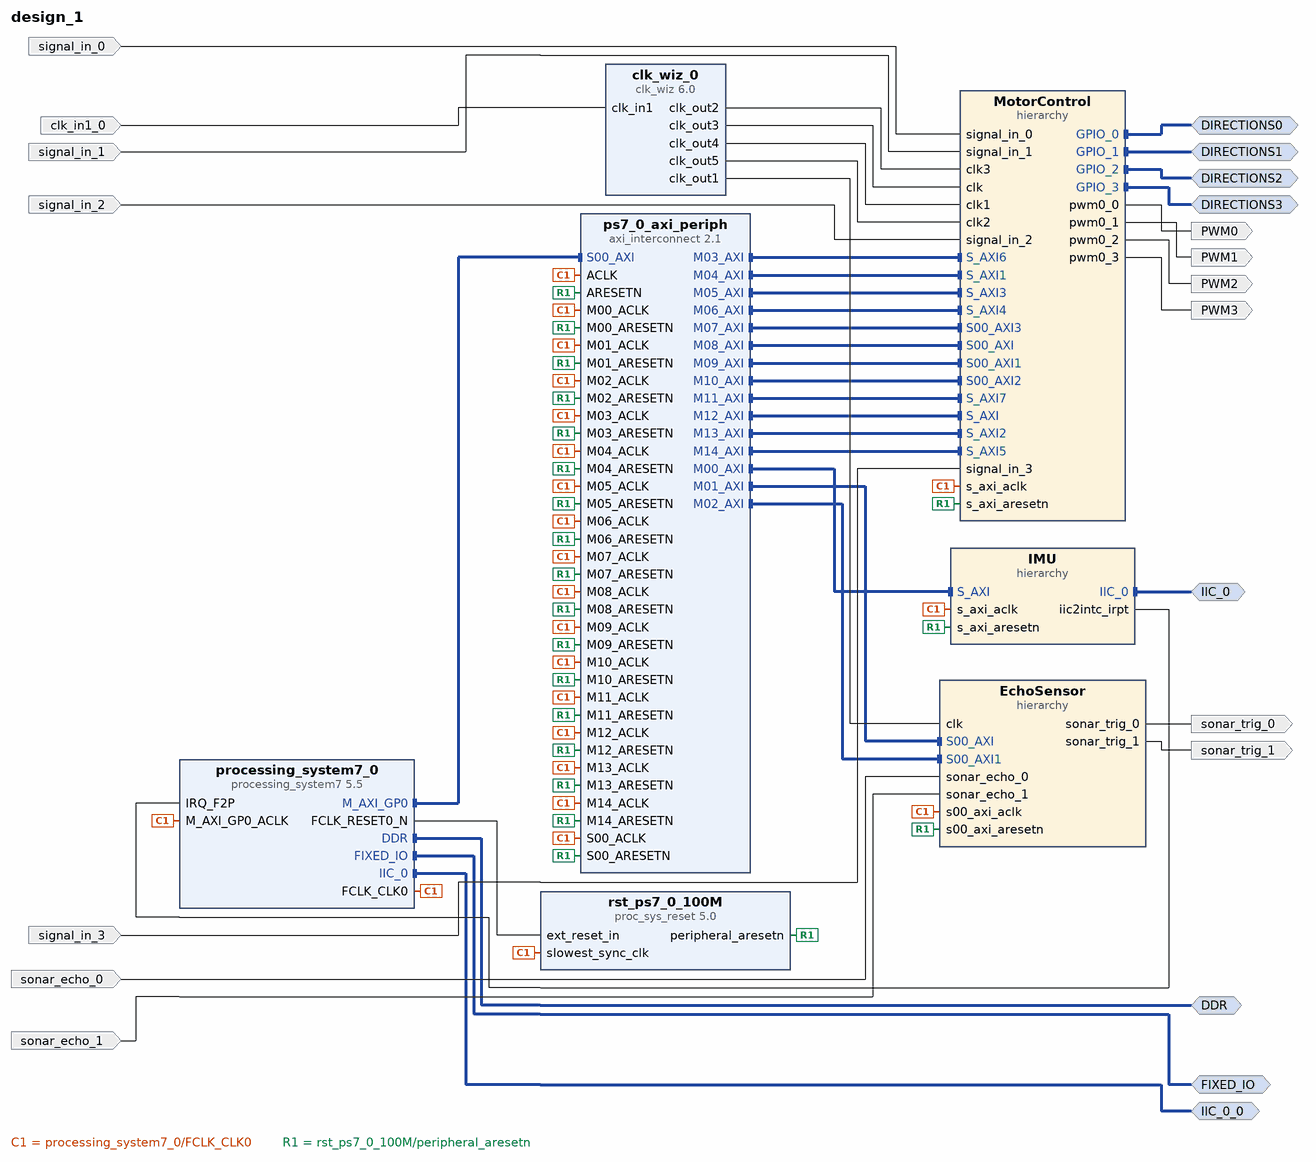
[diagram p0: block diagram of the top level]
# Vivado block design design_1, xc7z020clg400-1, Vivado 2024.1.2
create_bd_design design_1

create_bd_intf_port -mode Master -vlnv xilinx.com:interface:ddrx_rtl:1.0 DDR
create_bd_intf_port -mode Master -vlnv xilinx.com:display_processing_system7:fixedio_rtl:1.0 FIXED_IO
create_bd_intf_port -mode Master -vlnv xilinx.com:interface:iic_rtl:1.0 IIC_0
create_bd_intf_port -mode Master -vlnv xilinx.com:interface:iic_rtl:1.0 IIC_0_0
create_bd_intf_port -mode Master -vlnv xilinx.com:interface:gpio_rtl:1.0 DIRECTIONS0
create_bd_intf_port -mode Master -vlnv xilinx.com:interface:gpio_rtl:1.0 DIRECTIONS1
create_bd_intf_port -mode Master -vlnv xilinx.com:interface:gpio_rtl:1.0 DIRECTIONS2
create_bd_intf_port -mode Master -vlnv xilinx.com:interface:gpio_rtl:1.0 DIRECTIONS3
create_bd_port -dir O sonar_trig_0
create_bd_port -dir O sonar_trig_1
create_bd_port -dir I sonar_echo_0
create_bd_port -dir I sonar_echo_1
create_bd_port -dir I -type clk clk_in1_0
set_property -dict {CONFIG.FREQ_HZ 125000000} [get_bd_ports clk_in1_0]
create_bd_port -dir O PWM0
create_bd_port -dir O PWM1
create_bd_port -dir O PWM2
create_bd_port -dir O PWM3
create_bd_port -dir I signal_in_0
create_bd_port -dir I signal_in_1
create_bd_port -dir I signal_in_2
create_bd_port -dir I signal_in_3

create_bd_cell -type ip -vlnv xilinx.com:ip:processing_system7:5.5 processing_system7_0
set_property -dict [list \
  CONFIG.PCW_APU_PERIPHERAL_FREQMHZ 650 \
  CONFIG.PCW_CRYSTAL_PERIPHERAL_FREQMHZ 50 \
  CONFIG.PCW_ENET0_ENET0_IO {MIO 16 .. 27} \
  CONFIG.PCW_ENET0_GRP_MDIO_ENABLE 1 \
  CONFIG.PCW_ENET0_GRP_MDIO_IO {MIO 52 .. 53} \
  CONFIG.PCW_ENET0_PERIPHERAL_ENABLE 1 \
  CONFIG.PCW_ENET0_RESET_ENABLE 1 \
  CONFIG.PCW_ENET0_RESET_IO {MIO 9} \
  CONFIG.PCW_ENET_RESET_ENABLE 1 \
  CONFIG.PCW_ENET_RESET_SELECT {Share reset pin} \
  CONFIG.PCW_FPGA0_PERIPHERAL_FREQMHZ 100 \
  CONFIG.PCW_FPGA1_PERIPHERAL_FREQMHZ 50 \
  CONFIG.PCW_GPIO_MIO_GPIO_ENABLE 1 \
  CONFIG.PCW_GPIO_MIO_GPIO_IO MIO \
  CONFIG.PCW_I2C0_I2C0_IO EMIO \
  CONFIG.PCW_I2C0_PERIPHERAL_ENABLE 1 \
  CONFIG.PCW_I2C_PERIPHERAL_FREQMHZ 108.333336 \
  CONFIG.PCW_I2C_RESET_ENABLE 1 \
  CONFIG.PCW_I2C_RESET_SELECT {Share reset pin} \
  CONFIG.PCW_IRQ_F2P_INTR 1 \
  CONFIG.PCW_M_AXI_GP0_FREQMHZ 10 \
  CONFIG.PCW_PERIPHERAL_BOARD_PRESET None \
  CONFIG.PCW_PRESET_BANK1_VOLTAGE {LVCMOS 1.8V} \
  CONFIG.PCW_QSPI_GRP_FBCLK_ENABLE 1 \
  CONFIG.PCW_QSPI_GRP_FBCLK_IO {MIO 8} \
  CONFIG.PCW_QSPI_GRP_SINGLE_SS_ENABLE 1 \
  CONFIG.PCW_QSPI_GRP_SINGLE_SS_IO {MIO 1 .. 6} \
  CONFIG.PCW_QSPI_PERIPHERAL_ENABLE 1 \
  CONFIG.PCW_QSPI_QSPI_IO {MIO 1 .. 6} \
  CONFIG.PCW_SD0_GRP_CD_ENABLE 1 \
  CONFIG.PCW_SD0_GRP_CD_IO {MIO 47} \
  CONFIG.PCW_SD0_GRP_WP_ENABLE 0 \
  CONFIG.PCW_SD0_PERIPHERAL_ENABLE 1 \
  CONFIG.PCW_SD0_SD0_IO {MIO 40 .. 45} \
  CONFIG.PCW_SDIO_PERIPHERAL_FREQMHZ 50 \
  CONFIG.PCW_SINGLE_QSPI_DATA_MODE x4 \
  CONFIG.PCW_UART0_PERIPHERAL_ENABLE 1 \
  CONFIG.PCW_UART0_UART0_IO {MIO 14 .. 15} \
  CONFIG.PCW_UART1_PERIPHERAL_ENABLE 0 \
  CONFIG.PCW_UART_PERIPHERAL_FREQMHZ 100 \
  CONFIG.PCW_UIPARAM_DDR_BUS_WIDTH {16 Bit} \
  CONFIG.PCW_UIPARAM_DDR_FREQ_MHZ 525 \
  CONFIG.PCW_UIPARAM_DDR_PARTNO {MT41J256M16 RE-125} \
  CONFIG.PCW_USB0_PERIPHERAL_ENABLE 1 \
  CONFIG.PCW_USB0_RESET_ENABLE 1 \
  CONFIG.PCW_USB0_RESET_IO {MIO 46} \
  CONFIG.PCW_USB0_USB0_IO {MIO 28 .. 39} \
  CONFIG.PCW_USB_RESET_ENABLE 1 \
  CONFIG.PCW_USB_RESET_SELECT {Share reset pin} \
  CONFIG.PCW_USE_FABRIC_INTERRUPT 1 \
] [get_bd_cells processing_system7_0]
# 495 more settings of processing_system7_0 are not shown: defaults, MIO pin electricals, DDR timing, and values the tool derives
create_bd_cell -type ip -vlnv xilinx.com:ip:clk_wiz:6.0 clk_wiz_0
set_property -dict [list \
  CONFIG.CLKIN1_JITTER_PS 80.0 \
  CONFIG.CLKOUT1_JITTER 136.756 \
  CONFIG.CLKOUT1_PHASE_ERROR 122.096 \
  CONFIG.CLKOUT1_REQUESTED_DUTY_CYCLE 50.0 \
  CONFIG.CLKOUT2_JITTER 249.501 \
  CONFIG.CLKOUT2_PHASE_ERROR 122.096 \
  CONFIG.CLKOUT2_REQUESTED_OUT_FREQ 5 \
  CONFIG.CLKOUT2_USED true \
  CONFIG.CLKOUT3_JITTER 249.501 \
  CONFIG.CLKOUT3_PHASE_ERROR 122.096 \
  CONFIG.CLKOUT3_REQUESTED_OUT_FREQ 5 \
  CONFIG.CLKOUT3_USED true \
  CONFIG.CLKOUT4_JITTER 249.501 \
  CONFIG.CLKOUT4_PHASE_ERROR 122.096 \
  CONFIG.CLKOUT4_REQUESTED_OUT_FREQ 5 \
  CONFIG.CLKOUT4_USED true \
  CONFIG.CLKOUT5_JITTER 249.501 \
  CONFIG.CLKOUT5_PHASE_ERROR 122.096 \
  CONFIG.CLKOUT5_REQUESTED_OUT_FREQ 5 \
  CONFIG.CLKOUT5_USED true \
  CONFIG.MMCM_BANDWIDTH OPTIMIZED \
  CONFIG.MMCM_CLKFBOUT_MULT_F 5.000 \
  CONFIG.MMCM_CLKIN1_PERIOD 8.000 \
  CONFIG.MMCM_CLKOUT0_DIVIDE_F 6.250 \
  CONFIG.MMCM_CLKOUT1_DIVIDE 125 \
  CONFIG.MMCM_CLKOUT2_DIVIDE 125 \
  CONFIG.MMCM_CLKOUT3_DIVIDE 125 \
  CONFIG.MMCM_CLKOUT4_DIVIDE 125 \
  CONFIG.MMCM_DIVCLK_DIVIDE 1 \
  CONFIG.NUM_OUT_CLKS 5 \
  CONFIG.USE_LOCKED false \
  CONFIG.USE_RESET false \
  CONFIG.USE_SPREAD_SPECTRUM false \
] [get_bd_cells clk_wiz_0]
create_bd_cell -type ip -vlnv xilinx.com:ip:axi_interconnect:2.1 ps7_0_axi_periph
set_property -dict {CONFIG.NUM_MI 15} [get_bd_cells ps7_0_axi_periph]
create_bd_cell -type ip -vlnv xilinx.com:ip:proc_sys_reset:5.0 rst_ps7_0_100M
create_bd_cell -type hier MotorControl
create_bd_cell -type hier EchoSensor
create_bd_cell -type hier IMU

# ---- hierarchy /MotorControl ----
current_bd_instance /MotorControl
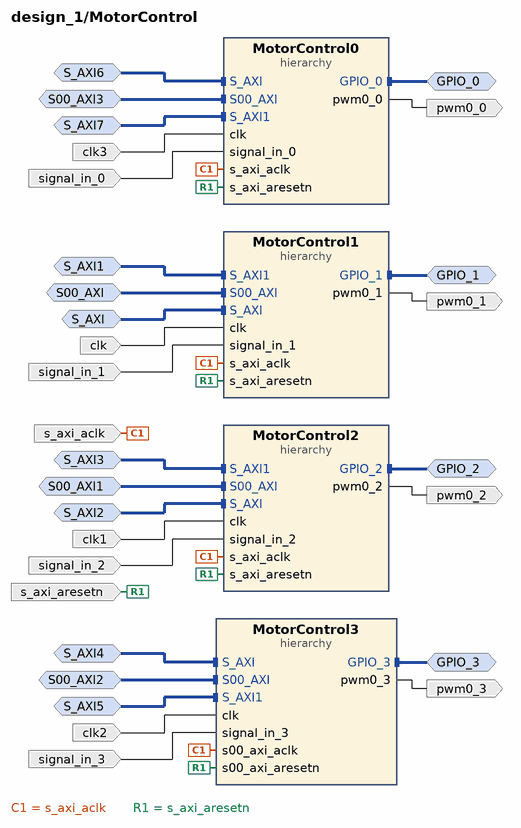
[diagram p1: block diagram inside /MotorControl]
create_bd_intf_pin -mode Slave -vlnv xilinx.com:interface:aximm_rtl:1.0 S00_AXI
create_bd_intf_pin -mode Slave -vlnv xilinx.com:interface:aximm_rtl:1.0 S_AXI
create_bd_intf_pin -mode Master -vlnv xilinx.com:interface:gpio_rtl:1.0 GPIO_1
create_bd_intf_pin -mode Slave -vlnv xilinx.com:interface:aximm_rtl:1.0 S_AXI1
create_bd_intf_pin -mode Slave -vlnv xilinx.com:interface:aximm_rtl:1.0 S00_AXI1
create_bd_intf_pin -mode Slave -vlnv xilinx.com:interface:aximm_rtl:1.0 S_AXI2
create_bd_intf_pin -mode Master -vlnv xilinx.com:interface:gpio_rtl:1.0 GPIO_2
create_bd_intf_pin -mode Slave -vlnv xilinx.com:interface:aximm_rtl:1.0 S_AXI3
create_bd_intf_pin -mode Slave -vlnv xilinx.com:interface:aximm_rtl:1.0 S_AXI4
create_bd_intf_pin -mode Slave -vlnv xilinx.com:interface:aximm_rtl:1.0 S_AXI5
create_bd_intf_pin -mode Master -vlnv xilinx.com:interface:gpio_rtl:1.0 GPIO_3
create_bd_intf_pin -mode Slave -vlnv xilinx.com:interface:aximm_rtl:1.0 S00_AXI2
create_bd_intf_pin -mode Master -vlnv xilinx.com:interface:gpio_rtl:1.0 GPIO_0
create_bd_intf_pin -mode Slave -vlnv xilinx.com:interface:aximm_rtl:1.0 S_AXI7
create_bd_intf_pin -mode Slave -vlnv xilinx.com:interface:aximm_rtl:1.0 S_AXI6
create_bd_intf_pin -mode Slave -vlnv xilinx.com:interface:aximm_rtl:1.0 S00_AXI3
create_bd_pin -dir I signal_in_1
create_bd_pin -dir I -type clk clk
create_bd_pin -dir I -type clk s_axi_aclk
create_bd_pin -dir I -type rst s_axi_aresetn
create_bd_pin -dir O pwm0_1
create_bd_pin -dir I signal_in_2
create_bd_pin -dir I -type clk clk1
create_bd_pin -dir O pwm0_2
create_bd_pin -dir O pwm0_3
create_bd_pin -dir I signal_in_3
create_bd_pin -dir I -type clk clk2
create_bd_pin -dir O pwm0_0
create_bd_pin -dir I -type clk clk3
create_bd_pin -dir I signal_in_0

create_bd_cell -type hier MotorControl1
create_bd_cell -type hier MotorControl2
create_bd_cell -type hier MotorControl3
create_bd_cell -type hier MotorControl0

# ---- hierarchy /MotorControl/MotorControl1 ----
current_bd_instance /MotorControl/MotorControl1
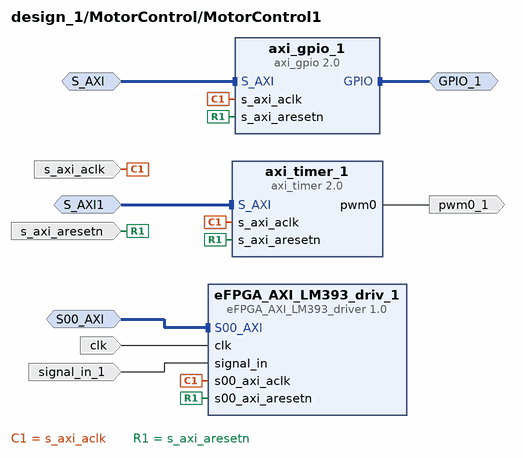
[diagram p2: block diagram inside /MotorControl/MotorControl1]
create_bd_intf_pin -mode Slave -vlnv xilinx.com:interface:aximm_rtl:1.0 S00_AXI
create_bd_intf_pin -mode Slave -vlnv xilinx.com:interface:aximm_rtl:1.0 S_AXI
create_bd_intf_pin -mode Master -vlnv xilinx.com:interface:gpio_rtl:1.0 GPIO_1
create_bd_intf_pin -mode Slave -vlnv xilinx.com:interface:aximm_rtl:1.0 S_AXI1
create_bd_pin -dir I signal_in_1
create_bd_pin -dir I -type clk clk
create_bd_pin -dir I -type clk s_axi_aclk
create_bd_pin -dir I -type rst s_axi_aresetn
create_bd_pin -dir O pwm0_1

create_bd_cell -type ip -vlnv xilinx.com:user:eFPGA_AXI_LM393_driver:1.0 eFPGA_AXI_LM393_driv_1
create_bd_cell -type ip -vlnv xilinx.com:ip:axi_gpio:2.0 axi_gpio_1
set_property -dict {CONFIG.C_ALL_OUTPUTS 1 CONFIG.C_GPIO_WIDTH 2} [get_bd_cells axi_gpio_1]
create_bd_cell -type ip -vlnv xilinx.com:ip:axi_timer:2.0 axi_timer_1

# ---- hierarchy /MotorControl/MotorControl2 ----
current_bd_instance /MotorControl/MotorControl2
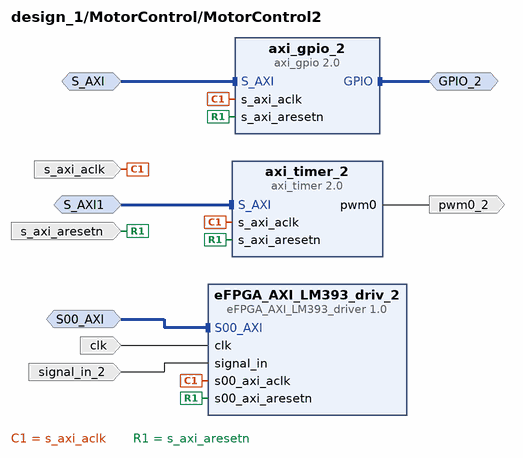
[diagram p3: block diagram inside /MotorControl/MotorControl2]
create_bd_intf_pin -mode Slave -vlnv xilinx.com:interface:aximm_rtl:1.0 S00_AXI
create_bd_intf_pin -mode Slave -vlnv xilinx.com:interface:aximm_rtl:1.0 S_AXI
create_bd_intf_pin -mode Master -vlnv xilinx.com:interface:gpio_rtl:1.0 GPIO_2
create_bd_intf_pin -mode Slave -vlnv xilinx.com:interface:aximm_rtl:1.0 S_AXI1
create_bd_pin -dir I signal_in_2
create_bd_pin -dir I -type clk clk
create_bd_pin -dir I -type clk s_axi_aclk
create_bd_pin -dir I -type rst s_axi_aresetn
create_bd_pin -dir O pwm0_2

create_bd_cell -type ip -vlnv xilinx.com:user:eFPGA_AXI_LM393_driver:1.0 eFPGA_AXI_LM393_driv_2
create_bd_cell -type ip -vlnv xilinx.com:ip:axi_gpio:2.0 axi_gpio_2
set_property -dict {CONFIG.C_ALL_OUTPUTS 1 CONFIG.C_GPIO_WIDTH 2} [get_bd_cells axi_gpio_2]
create_bd_cell -type ip -vlnv xilinx.com:ip:axi_timer:2.0 axi_timer_2

# ---- hierarchy /MotorControl/MotorControl3 ----
current_bd_instance /MotorControl/MotorControl3
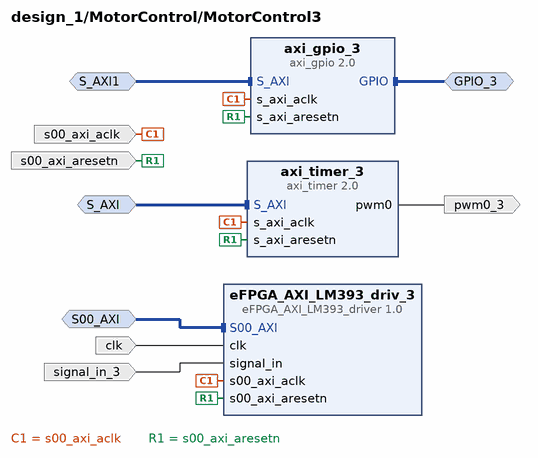
[diagram p4: block diagram inside /MotorControl/MotorControl3]
create_bd_intf_pin -mode Slave -vlnv xilinx.com:interface:aximm_rtl:1.0 S_AXI
create_bd_intf_pin -mode Slave -vlnv xilinx.com:interface:aximm_rtl:1.0 S_AXI1
create_bd_intf_pin -mode Master -vlnv xilinx.com:interface:gpio_rtl:1.0 GPIO_3
create_bd_intf_pin -mode Slave -vlnv xilinx.com:interface:aximm_rtl:1.0 S00_AXI
create_bd_pin -dir O pwm0_3
create_bd_pin -dir I -type clk s00_axi_aclk
create_bd_pin -dir I -type rst s00_axi_aresetn
create_bd_pin -dir I signal_in_3
create_bd_pin -dir I -type clk clk

create_bd_cell -type ip -vlnv xilinx.com:ip:axi_timer:2.0 axi_timer_3
create_bd_cell -type ip -vlnv xilinx.com:ip:axi_gpio:2.0 axi_gpio_3
set_property -dict {CONFIG.C_ALL_OUTPUTS 1 CONFIG.C_GPIO_WIDTH 2} [get_bd_cells axi_gpio_3]
create_bd_cell -type ip -vlnv xilinx.com:user:eFPGA_AXI_LM393_driver:1.0 eFPGA_AXI_LM393_driv_3

# ---- hierarchy /MotorControl/MotorControl0 ----
current_bd_instance /MotorControl/MotorControl0
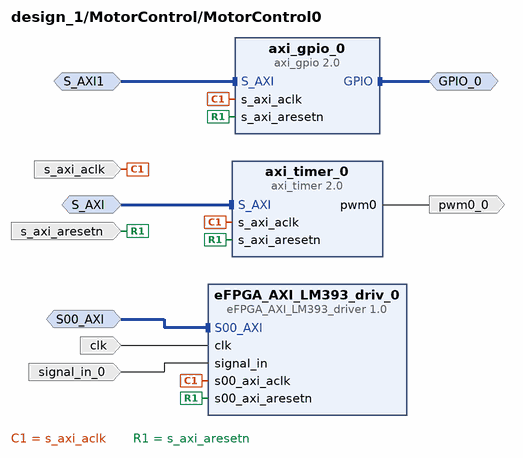
[diagram p5: block diagram inside /MotorControl/MotorControl0]
create_bd_intf_pin -mode Slave -vlnv xilinx.com:interface:aximm_rtl:1.0 S00_AXI
create_bd_intf_pin -mode Slave -vlnv xilinx.com:interface:aximm_rtl:1.0 S_AXI
create_bd_intf_pin -mode Slave -vlnv xilinx.com:interface:aximm_rtl:1.0 S_AXI1
create_bd_intf_pin -mode Master -vlnv xilinx.com:interface:gpio_rtl:1.0 GPIO_0
create_bd_pin -dir I signal_in_0
create_bd_pin -dir I -type clk clk
create_bd_pin -dir I -type clk s_axi_aclk
create_bd_pin -dir I -type rst s_axi_aresetn
create_bd_pin -dir O pwm0_0

create_bd_cell -type ip -vlnv xilinx.com:user:eFPGA_AXI_LM393_driver:1.0 eFPGA_AXI_LM393_driv_0
create_bd_cell -type ip -vlnv xilinx.com:ip:axi_timer:2.0 axi_timer_0
create_bd_cell -type ip -vlnv xilinx.com:ip:axi_gpio:2.0 axi_gpio_0
set_property -dict {CONFIG.C_ALL_OUTPUTS 1 CONFIG.C_GPIO_WIDTH 2} [get_bd_cells axi_gpio_0]

# ---- hierarchy /EchoSensor ----
current_bd_instance /EchoSensor
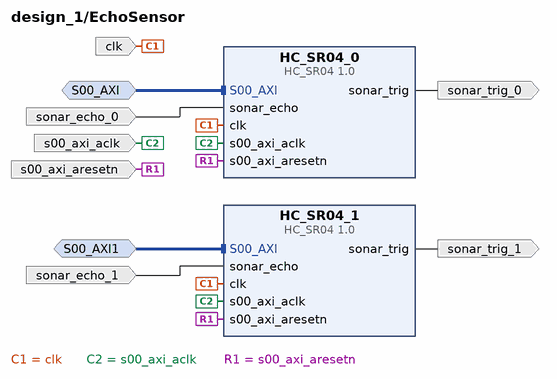
[diagram p6: block diagram inside /EchoSensor]
create_bd_intf_pin -mode Slave -vlnv xilinx.com:interface:aximm_rtl:1.0 S00_AXI
create_bd_intf_pin -mode Slave -vlnv xilinx.com:interface:aximm_rtl:1.0 S00_AXI1
create_bd_pin -dir I -type clk clk
create_bd_pin -dir O sonar_trig_0
create_bd_pin -dir I sonar_echo_0
create_bd_pin -dir I -type clk s00_axi_aclk
create_bd_pin -dir I -type rst s00_axi_aresetn
create_bd_pin -dir O sonar_trig_1
create_bd_pin -dir I sonar_echo_1

create_bd_cell -type ip -vlnv xilinx.com:user:HC_SR04:1.0 HC_SR04_0
create_bd_cell -type ip -vlnv xilinx.com:user:HC_SR04:1.0 HC_SR04_1

# ---- hierarchy /IMU ----
current_bd_instance /IMU
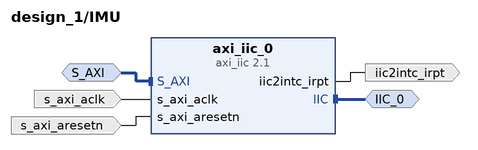
[diagram p7: block diagram inside /IMU]
create_bd_intf_pin -mode Slave -vlnv xilinx.com:interface:aximm_rtl:1.0 S_AXI
create_bd_intf_pin -mode Master -vlnv xilinx.com:interface:iic_rtl:1.0 IIC_0
create_bd_pin -dir I -type clk s_axi_aclk
create_bd_pin -dir I -type rst s_axi_aresetn
create_bd_pin -dir O -type intr iic2intc_irpt

create_bd_cell -type ip -vlnv xilinx.com:ip:axi_iic:2.1 axi_iic_0

# ---- connections ----

current_bd_instance /MotorControl
connect_bd_intf_net -intf_net axi_gpio_0_GPIO [get_bd_intf_pins GPIO_0] [get_bd_intf_pins MotorControl0/GPIO_0]
connect_bd_intf_net -intf_net axi_gpio_1_GPIO [get_bd_intf_pins GPIO_1] [get_bd_intf_pins MotorControl1/GPIO_1]
connect_bd_intf_net -intf_net axi_gpio_2_GPIO [get_bd_intf_pins GPIO_2] [get_bd_intf_pins MotorControl2/GPIO_2]
connect_bd_intf_net -intf_net axi_gpio_3_GPIO [get_bd_intf_pins GPIO_3] [get_bd_intf_pins MotorControl3/GPIO_3]
connect_bd_intf_net [get_bd_intf_pins S_AXI6] [get_bd_intf_pins MotorControl0/S_AXI]
connect_bd_intf_net [get_bd_intf_pins S_AXI1] [get_bd_intf_pins MotorControl1/S_AXI1]
connect_bd_intf_net [get_bd_intf_pins S_AXI3] [get_bd_intf_pins MotorControl2/S_AXI1]
connect_bd_intf_net [get_bd_intf_pins S_AXI4] [get_bd_intf_pins MotorControl3/S_AXI]
connect_bd_intf_net [get_bd_intf_pins S00_AXI3] [get_bd_intf_pins MotorControl0/S00_AXI]
connect_bd_intf_net [get_bd_intf_pins S00_AXI] [get_bd_intf_pins MotorControl1/S00_AXI]
connect_bd_intf_net [get_bd_intf_pins S00_AXI1] [get_bd_intf_pins MotorControl2/S00_AXI]
connect_bd_intf_net [get_bd_intf_pins S00_AXI2] [get_bd_intf_pins MotorControl3/S00_AXI]
connect_bd_intf_net [get_bd_intf_pins S_AXI7] [get_bd_intf_pins MotorControl0/S_AXI1]
connect_bd_intf_net [get_bd_intf_pins S_AXI] [get_bd_intf_pins MotorControl1/S_AXI]
connect_bd_intf_net [get_bd_intf_pins S_AXI2] [get_bd_intf_pins MotorControl2/S_AXI]
connect_bd_intf_net [get_bd_intf_pins S_AXI5] [get_bd_intf_pins MotorControl3/S_AXI1]
connect_bd_net -net axi_timer_0_pwm0 [get_bd_pins MotorControl0/pwm0_0] [get_bd_pins pwm0_0]
connect_bd_net -net axi_timer_1_pwm0 [get_bd_pins MotorControl1/pwm0_1] [get_bd_pins pwm0_1]
connect_bd_net -net axi_timer_2_pwm0 [get_bd_pins MotorControl2/pwm0_2] [get_bd_pins pwm0_2]
connect_bd_net -net axi_timer_3_pwm0 [get_bd_pins MotorControl3/pwm0_3] [get_bd_pins pwm0_3]
connect_bd_net -net clk_wiz_0_clk_out2 [get_bd_pins clk3] [get_bd_pins MotorControl0/clk]
connect_bd_net -net clk_wiz_0_clk_out3 [get_bd_pins clk] [get_bd_pins MotorControl1/clk]
connect_bd_net -net clk_wiz_0_clk_out4 [get_bd_pins clk1] [get_bd_pins MotorControl2/clk]
connect_bd_net -net clk_wiz_0_clk_out5 [get_bd_pins clk2] [get_bd_pins MotorControl3/clk]
connect_bd_net -net processing_system7_0_FCLK_CLK0 [get_bd_pins s_axi_aclk] \
  [get_bd_pins MotorControl2/s_axi_aclk] [get_bd_pins MotorControl3/s00_axi_aclk] [get_bd_pins MotorControl1/s_axi_aclk] \
  [get_bd_pins MotorControl0/s_axi_aclk]
connect_bd_net -net rst_ps7_0_100M_peripheral_aresetn [get_bd_pins s_axi_aresetn] \
  [get_bd_pins MotorControl2/s_axi_aresetn] [get_bd_pins MotorControl3/s00_axi_aresetn] \
  [get_bd_pins MotorControl1/s_axi_aresetn] [get_bd_pins MotorControl0/s_axi_aresetn]
connect_bd_net -net signal_in_0_1 [get_bd_pins signal_in_0] [get_bd_pins MotorControl0/signal_in_0]
connect_bd_net -net signal_in_1_1 [get_bd_pins signal_in_1] [get_bd_pins MotorControl1/signal_in_1]
connect_bd_net -net signal_in_2_1 [get_bd_pins signal_in_2] [get_bd_pins MotorControl2/signal_in_2]
connect_bd_net -net signal_in_3_1 [get_bd_pins signal_in_3] [get_bd_pins MotorControl3/signal_in_3]

current_bd_instance /MotorControl/MotorControl1
connect_bd_intf_net [get_bd_intf_pins GPIO_1] [get_bd_intf_pins axi_gpio_1/GPIO]
connect_bd_intf_net [get_bd_intf_pins S_AXI1] [get_bd_intf_pins axi_timer_1/S_AXI]
connect_bd_intf_net [get_bd_intf_pins S00_AXI] [get_bd_intf_pins eFPGA_AXI_LM393_driv_1/S00_AXI]
connect_bd_intf_net [get_bd_intf_pins S_AXI] [get_bd_intf_pins axi_gpio_1/S_AXI]
connect_bd_net [get_bd_pins axi_timer_1/pwm0] [get_bd_pins pwm0_1]
connect_bd_net -net clk_wiz_0_clk_out3 [get_bd_pins clk] [get_bd_pins eFPGA_AXI_LM393_driv_1/clk]
connect_bd_net -net processing_system7_0_FCLK_CLK0 [get_bd_pins s_axi_aclk] \
  [get_bd_pins axi_timer_1/s_axi_aclk] [get_bd_pins axi_gpio_1/s_axi_aclk] [get_bd_pins eFPGA_AXI_LM393_driv_1/s00_axi_aclk]
connect_bd_net -net rst_ps7_0_100M_peripheral_aresetn [get_bd_pins s_axi_aresetn] \
  [get_bd_pins axi_timer_1/s_axi_aresetn] [get_bd_pins axi_gpio_1/s_axi_aresetn] \
  [get_bd_pins eFPGA_AXI_LM393_driv_1/s00_axi_aresetn]
connect_bd_net -net signal_in_1_1 [get_bd_pins signal_in_1] [get_bd_pins eFPGA_AXI_LM393_driv_1/signal_in]

current_bd_instance /MotorControl/MotorControl2
connect_bd_intf_net [get_bd_intf_pins GPIO_2] [get_bd_intf_pins axi_gpio_2/GPIO]
connect_bd_intf_net [get_bd_intf_pins S_AXI1] [get_bd_intf_pins axi_timer_2/S_AXI]
connect_bd_intf_net [get_bd_intf_pins S00_AXI] [get_bd_intf_pins eFPGA_AXI_LM393_driv_2/S00_AXI]
connect_bd_intf_net [get_bd_intf_pins S_AXI] [get_bd_intf_pins axi_gpio_2/S_AXI]
connect_bd_net [get_bd_pins axi_timer_2/pwm0] [get_bd_pins pwm0_2]
connect_bd_net -net clk_wiz_0_clk_out4 [get_bd_pins clk] [get_bd_pins eFPGA_AXI_LM393_driv_2/clk]
connect_bd_net -net processing_system7_0_FCLK_CLK0 [get_bd_pins s_axi_aclk] \
  [get_bd_pins axi_timer_2/s_axi_aclk] [get_bd_pins axi_gpio_2/s_axi_aclk] [get_bd_pins eFPGA_AXI_LM393_driv_2/s00_axi_aclk]
connect_bd_net -net rst_ps7_0_100M_peripheral_aresetn [get_bd_pins s_axi_aresetn] \
  [get_bd_pins axi_timer_2/s_axi_aresetn] [get_bd_pins axi_gpio_2/s_axi_aresetn] \
  [get_bd_pins eFPGA_AXI_LM393_driv_2/s00_axi_aresetn]
connect_bd_net -net signal_in_2_1 [get_bd_pins signal_in_2] [get_bd_pins eFPGA_AXI_LM393_driv_2/signal_in]

current_bd_instance /MotorControl/MotorControl3
connect_bd_intf_net [get_bd_intf_pins GPIO_3] [get_bd_intf_pins axi_gpio_3/GPIO]
connect_bd_intf_net [get_bd_intf_pins S_AXI] [get_bd_intf_pins axi_timer_3/S_AXI]
connect_bd_intf_net [get_bd_intf_pins S00_AXI] [get_bd_intf_pins eFPGA_AXI_LM393_driv_3/S00_AXI]
connect_bd_intf_net [get_bd_intf_pins S_AXI1] [get_bd_intf_pins axi_gpio_3/S_AXI]
connect_bd_net [get_bd_pins axi_timer_3/pwm0] [get_bd_pins pwm0_3]
connect_bd_net -net clk_wiz_0_clk_out5 [get_bd_pins clk] [get_bd_pins eFPGA_AXI_LM393_driv_3/clk]
connect_bd_net -net processing_system7_0_FCLK_CLK0 [get_bd_pins s00_axi_aclk] \
  [get_bd_pins eFPGA_AXI_LM393_driv_3/s00_axi_aclk] [get_bd_pins axi_gpio_3/s_axi_aclk] [get_bd_pins axi_timer_3/s_axi_aclk]
connect_bd_net -net rst_ps7_0_100M_peripheral_aresetn [get_bd_pins s00_axi_aresetn] \
  [get_bd_pins eFPGA_AXI_LM393_driv_3/s00_axi_aresetn] [get_bd_pins axi_gpio_3/s_axi_aresetn] \
  [get_bd_pins axi_timer_3/s_axi_aresetn]
connect_bd_net -net signal_in_3_1 [get_bd_pins signal_in_3] [get_bd_pins eFPGA_AXI_LM393_driv_3/signal_in]

current_bd_instance /MotorControl/MotorControl0
connect_bd_intf_net [get_bd_intf_pins GPIO_0] [get_bd_intf_pins axi_gpio_0/GPIO]
connect_bd_intf_net [get_bd_intf_pins S_AXI] [get_bd_intf_pins axi_timer_0/S_AXI]
connect_bd_intf_net [get_bd_intf_pins S00_AXI] [get_bd_intf_pins eFPGA_AXI_LM393_driv_0/S00_AXI]
connect_bd_intf_net [get_bd_intf_pins S_AXI1] [get_bd_intf_pins axi_gpio_0/S_AXI]
connect_bd_net [get_bd_pins axi_timer_0/pwm0] [get_bd_pins pwm0_0]
connect_bd_net -net clk_wiz_0_clk_out2 [get_bd_pins clk] [get_bd_pins eFPGA_AXI_LM393_driv_0/clk]
connect_bd_net -net processing_system7_0_FCLK_CLK0 [get_bd_pins s_axi_aclk] \
  [get_bd_pins axi_timer_0/s_axi_aclk] [get_bd_pins axi_gpio_0/s_axi_aclk] [get_bd_pins eFPGA_AXI_LM393_driv_0/s00_axi_aclk]
connect_bd_net -net rst_ps7_0_100M_peripheral_aresetn [get_bd_pins s_axi_aresetn] \
  [get_bd_pins axi_timer_0/s_axi_aresetn] [get_bd_pins axi_gpio_0/s_axi_aresetn] \
  [get_bd_pins eFPGA_AXI_LM393_driv_0/s00_axi_aresetn]
connect_bd_net -net signal_in_0_1 [get_bd_pins signal_in_0] [get_bd_pins eFPGA_AXI_LM393_driv_0/signal_in]

current_bd_instance /EchoSensor
connect_bd_intf_net [get_bd_intf_pins S00_AXI] [get_bd_intf_pins HC_SR04_0/S00_AXI]
connect_bd_intf_net [get_bd_intf_pins S00_AXI1] [get_bd_intf_pins HC_SR04_1/S00_AXI]
connect_bd_net [get_bd_pins HC_SR04_0/sonar_trig] [get_bd_pins sonar_trig_0]
connect_bd_net [get_bd_pins HC_SR04_1/sonar_trig] [get_bd_pins sonar_trig_1]
connect_bd_net -net clk_wiz_0_clk_out1 [get_bd_pins clk] [get_bd_pins HC_SR04_1/clk] [get_bd_pins HC_SR04_0/clk]
connect_bd_net -net processing_system7_0_FCLK_CLK0 [get_bd_pins s00_axi_aclk] \
  [get_bd_pins HC_SR04_1/s00_axi_aclk] [get_bd_pins HC_SR04_0/s00_axi_aclk]
connect_bd_net -net rst_ps7_0_100M_peripheral_aresetn [get_bd_pins s00_axi_aresetn] \
  [get_bd_pins HC_SR04_1/s00_axi_aresetn] [get_bd_pins HC_SR04_0/s00_axi_aresetn]
connect_bd_net -net sonar_echo_0_1 [get_bd_pins sonar_echo_0] [get_bd_pins HC_SR04_0/sonar_echo]
connect_bd_net -net sonar_echo_1_1 [get_bd_pins sonar_echo_1] [get_bd_pins HC_SR04_1/sonar_echo]

current_bd_instance /IMU
connect_bd_intf_net [get_bd_intf_pins IIC_0] [get_bd_intf_pins axi_iic_0/IIC]
connect_bd_intf_net [get_bd_intf_pins S_AXI] [get_bd_intf_pins axi_iic_0/S_AXI]
connect_bd_net [get_bd_pins axi_iic_0/iic2intc_irpt] [get_bd_pins iic2intc_irpt]
connect_bd_net -net processing_system7_0_FCLK_CLK0 [get_bd_pins s_axi_aclk] [get_bd_pins axi_iic_0/s_axi_aclk]
connect_bd_net -net rst_ps7_0_100M_peripheral_aresetn [get_bd_pins s_axi_aresetn] [get_bd_pins axi_iic_0/s_axi_aresetn]

current_bd_instance /
connect_bd_intf_net -intf_net axi_gpio_0_GPIO [get_bd_intf_ports DIRECTIONS0] [get_bd_intf_pins MotorControl/GPIO_0]
connect_bd_intf_net -intf_net axi_gpio_1_GPIO [get_bd_intf_ports DIRECTIONS1] [get_bd_intf_pins MotorControl/GPIO_1]
connect_bd_intf_net -intf_net axi_gpio_2_GPIO [get_bd_intf_ports DIRECTIONS2] [get_bd_intf_pins MotorControl/GPIO_2]
connect_bd_intf_net -intf_net axi_gpio_3_GPIO [get_bd_intf_ports DIRECTIONS3] [get_bd_intf_pins MotorControl/GPIO_3]
connect_bd_intf_net -intf_net axi_iic_0_IIC [get_bd_intf_ports IIC_0] [get_bd_intf_pins IMU/IIC_0]
connect_bd_intf_net [get_bd_intf_ports DDR] [get_bd_intf_pins processing_system7_0/DDR]
connect_bd_intf_net [get_bd_intf_ports FIXED_IO] [get_bd_intf_pins processing_system7_0/FIXED_IO]
connect_bd_intf_net [get_bd_intf_ports IIC_0_0] [get_bd_intf_pins processing_system7_0/IIC_0]
connect_bd_intf_net [get_bd_intf_pins processing_system7_0/M_AXI_GP0] [get_bd_intf_pins ps7_0_axi_periph/S00_AXI]
connect_bd_intf_net [get_bd_intf_pins ps7_0_axi_periph/M00_AXI] [get_bd_intf_pins IMU/S_AXI]
connect_bd_intf_net [get_bd_intf_pins ps7_0_axi_periph/M01_AXI] [get_bd_intf_pins EchoSensor/S00_AXI]
connect_bd_intf_net [get_bd_intf_pins ps7_0_axi_periph/M02_AXI] [get_bd_intf_pins EchoSensor/S00_AXI1]
connect_bd_intf_net [get_bd_intf_pins ps7_0_axi_periph/M03_AXI] [get_bd_intf_pins MotorControl/S_AXI6]
connect_bd_intf_net [get_bd_intf_pins ps7_0_axi_periph/M04_AXI] [get_bd_intf_pins MotorControl/S_AXI1]
connect_bd_intf_net [get_bd_intf_pins ps7_0_axi_periph/M05_AXI] [get_bd_intf_pins MotorControl/S_AXI3]
connect_bd_intf_net [get_bd_intf_pins ps7_0_axi_periph/M06_AXI] [get_bd_intf_pins MotorControl/S_AXI4]
connect_bd_intf_net [get_bd_intf_pins ps7_0_axi_periph/M07_AXI] [get_bd_intf_pins MotorControl/S00_AXI3]
connect_bd_intf_net [get_bd_intf_pins ps7_0_axi_periph/M08_AXI] [get_bd_intf_pins MotorControl/S00_AXI]
connect_bd_intf_net [get_bd_intf_pins ps7_0_axi_periph/M09_AXI] [get_bd_intf_pins MotorControl/S00_AXI1]
connect_bd_intf_net [get_bd_intf_pins ps7_0_axi_periph/M10_AXI] [get_bd_intf_pins MotorControl/S00_AXI2]
connect_bd_intf_net [get_bd_intf_pins ps7_0_axi_periph/M11_AXI] [get_bd_intf_pins MotorControl/S_AXI7]
connect_bd_intf_net [get_bd_intf_pins ps7_0_axi_periph/M12_AXI] [get_bd_intf_pins MotorControl/S_AXI]
connect_bd_intf_net [get_bd_intf_pins ps7_0_axi_periph/M13_AXI] [get_bd_intf_pins MotorControl/S_AXI2]
connect_bd_intf_net [get_bd_intf_pins ps7_0_axi_periph/M14_AXI] [get_bd_intf_pins MotorControl/S_AXI5]
connect_bd_net -net HC_SR04_0_sonar_trig [get_bd_pins EchoSensor/sonar_trig_0] [get_bd_ports sonar_trig_0]
connect_bd_net -net HC_SR04_1_sonar_trig [get_bd_pins EchoSensor/sonar_trig_1] [get_bd_ports sonar_trig_1]
connect_bd_net -net axi_iic_0_iic2intc_irpt [get_bd_pins IMU/iic2intc_irpt] [get_bd_pins processing_system7_0/IRQ_F2P]
connect_bd_net -net axi_timer_0_pwm0 [get_bd_pins MotorControl/pwm0_0] [get_bd_ports PWM0]
connect_bd_net -net axi_timer_1_pwm0 [get_bd_pins MotorControl/pwm0_1] [get_bd_ports PWM1]
connect_bd_net -net axi_timer_2_pwm0 [get_bd_pins MotorControl/pwm0_2] [get_bd_ports PWM2]
connect_bd_net -net axi_timer_3_pwm0 [get_bd_pins MotorControl/pwm0_3] [get_bd_ports PWM3]
connect_bd_net -net clk_in1_0_1 [get_bd_ports clk_in1_0] [get_bd_pins clk_wiz_0/clk_in1]
connect_bd_net [get_bd_pins clk_wiz_0/clk_out1] [get_bd_pins EchoSensor/clk]
connect_bd_net [get_bd_pins clk_wiz_0/clk_out2] [get_bd_pins MotorControl/clk3]
connect_bd_net [get_bd_pins clk_wiz_0/clk_out3] [get_bd_pins MotorControl/clk]
connect_bd_net [get_bd_pins clk_wiz_0/clk_out4] [get_bd_pins MotorControl/clk1]
connect_bd_net [get_bd_pins clk_wiz_0/clk_out5] [get_bd_pins MotorControl/clk2]
connect_bd_net [get_bd_pins processing_system7_0/FCLK_CLK0] \
  [get_bd_pins processing_system7_0/M_AXI_GP0_ACLK] [get_bd_pins ps7_0_axi_periph/S00_ACLK] \
  [get_bd_pins rst_ps7_0_100M/slowest_sync_clk] [get_bd_pins ps7_0_axi_periph/M00_ACLK] [get_bd_pins ps7_0_axi_periph/ACLK] \
  [get_bd_pins ps7_0_axi_periph/M01_ACLK] [get_bd_pins ps7_0_axi_periph/M02_ACLK] [get_bd_pins ps7_0_axi_periph/M03_ACLK] \
  [get_bd_pins ps7_0_axi_periph/M04_ACLK] [get_bd_pins ps7_0_axi_periph/M05_ACLK] [get_bd_pins ps7_0_axi_periph/M06_ACLK] \
  [get_bd_pins ps7_0_axi_periph/M07_ACLK] [get_bd_pins ps7_0_axi_periph/M08_ACLK] [get_bd_pins ps7_0_axi_periph/M09_ACLK] \
  [get_bd_pins ps7_0_axi_periph/M10_ACLK] [get_bd_pins ps7_0_axi_periph/M11_ACLK] [get_bd_pins ps7_0_axi_periph/M12_ACLK] \
  [get_bd_pins ps7_0_axi_periph/M13_ACLK] [get_bd_pins ps7_0_axi_periph/M14_ACLK] [get_bd_pins MotorControl/s_axi_aclk] \
  [get_bd_pins EchoSensor/s00_axi_aclk] [get_bd_pins IMU/s_axi_aclk]
connect_bd_net [get_bd_pins processing_system7_0/FCLK_RESET0_N] [get_bd_pins rst_ps7_0_100M/ext_reset_in]
connect_bd_net [get_bd_pins rst_ps7_0_100M/peripheral_aresetn] \
  [get_bd_pins ps7_0_axi_periph/S00_ARESETN] [get_bd_pins ps7_0_axi_periph/M00_ARESETN] \
  [get_bd_pins ps7_0_axi_periph/ARESETN] [get_bd_pins ps7_0_axi_periph/M01_ARESETN] \
  [get_bd_pins ps7_0_axi_periph/M02_ARESETN] [get_bd_pins ps7_0_axi_periph/M03_ARESETN] \
  [get_bd_pins ps7_0_axi_periph/M04_ARESETN] [get_bd_pins ps7_0_axi_periph/M05_ARESETN] \
  [get_bd_pins ps7_0_axi_periph/M06_ARESETN] [get_bd_pins ps7_0_axi_periph/M07_ARESETN] \
  [get_bd_pins ps7_0_axi_periph/M08_ARESETN] [get_bd_pins ps7_0_axi_periph/M09_ARESETN] \
  [get_bd_pins ps7_0_axi_periph/M10_ARESETN] [get_bd_pins ps7_0_axi_periph/M11_ARESETN] \
  [get_bd_pins ps7_0_axi_periph/M12_ARESETN] [get_bd_pins ps7_0_axi_periph/M13_ARESETN] \
  [get_bd_pins ps7_0_axi_periph/M14_ARESETN] [get_bd_pins MotorControl/s_axi_aresetn] \
  [get_bd_pins EchoSensor/s00_axi_aresetn] [get_bd_pins IMU/s_axi_aresetn]
connect_bd_net -net signal_in_0_1 [get_bd_ports signal_in_0] [get_bd_pins MotorControl/signal_in_0]
connect_bd_net -net signal_in_1_1 [get_bd_ports signal_in_1] [get_bd_pins MotorControl/signal_in_1]
connect_bd_net -net signal_in_2_1 [get_bd_ports signal_in_2] [get_bd_pins MotorControl/signal_in_2]
connect_bd_net -net signal_in_3_1 [get_bd_ports signal_in_3] [get_bd_pins MotorControl/signal_in_3]
connect_bd_net -net sonar_echo_0_1 [get_bd_ports sonar_echo_0] [get_bd_pins EchoSensor/sonar_echo_0]
connect_bd_net -net sonar_echo_1_1 [get_bd_ports sonar_echo_1] [get_bd_pins EchoSensor/sonar_echo_1]

# ---- address map ----
assign_bd_address -offset 0x41200000 -range 64K -target_address_space [get_bd_addr_spaces processing_system7_0/Data] [get_bd_addr_segs MotorControl/MotorControl0/axi_gpio_0/S_AXI/Reg]
assign_bd_address -offset 0x41210000 -range 64K -target_address_space [get_bd_addr_spaces processing_system7_0/Data] [get_bd_addr_segs MotorControl/MotorControl1/axi_gpio_1/S_AXI/Reg]
assign_bd_address -offset 0x41220000 -range 64K -target_address_space [get_bd_addr_spaces processing_system7_0/Data] [get_bd_addr_segs MotorControl/MotorControl2/axi_gpio_2/S_AXI/Reg]
assign_bd_address -offset 0x41230000 -range 64K -target_address_space [get_bd_addr_spaces processing_system7_0/Data] [get_bd_addr_segs MotorControl/MotorControl3/axi_gpio_3/S_AXI/Reg]
assign_bd_address -offset 0x41600000 -range 64K -target_address_space [get_bd_addr_spaces processing_system7_0/Data] [get_bd_addr_segs IMU/axi_iic_0/S_AXI/Reg]
assign_bd_address -offset 0x42800000 -range 64K -target_address_space [get_bd_addr_spaces processing_system7_0/Data] [get_bd_addr_segs MotorControl/MotorControl0/axi_timer_0/S_AXI/Reg]
assign_bd_address -offset 0x42810000 -range 64K -target_address_space [get_bd_addr_spaces processing_system7_0/Data] [get_bd_addr_segs MotorControl/MotorControl1/axi_timer_1/S_AXI/Reg]
assign_bd_address -offset 0x42820000 -range 64K -target_address_space [get_bd_addr_spaces processing_system7_0/Data] [get_bd_addr_segs MotorControl/MotorControl2/axi_timer_2/S_AXI/Reg]
assign_bd_address -offset 0x42830000 -range 64K -target_address_space [get_bd_addr_spaces processing_system7_0/Data] [get_bd_addr_segs MotorControl/MotorControl3/axi_timer_3/S_AXI/Reg]
assign_bd_address -offset 0x43C00000 -range 64K -target_address_space [get_bd_addr_spaces processing_system7_0/Data] [get_bd_addr_segs EchoSensor/HC_SR04_0/S00_AXI/S00_AXI_reg]
assign_bd_address -offset 0x43C10000 -range 64K -target_address_space [get_bd_addr_spaces processing_system7_0/Data] [get_bd_addr_segs EchoSensor/HC_SR04_1/S00_AXI/S00_AXI_reg]
assign_bd_address -offset 0x43C20000 -range 64K -target_address_space [get_bd_addr_spaces processing_system7_0/Data] [get_bd_addr_segs MotorControl/MotorControl0/eFPGA_AXI_LM393_driv_0/S00_AXI/S00_AXI_reg]
assign_bd_address -offset 0x43C30000 -range 64K -target_address_space [get_bd_addr_spaces processing_system7_0/Data] [get_bd_addr_segs MotorControl/MotorControl1/eFPGA_AXI_LM393_driv_1/S00_AXI/S00_AXI_reg]
assign_bd_address -offset 0x43C40000 -range 64K -target_address_space [get_bd_addr_spaces processing_system7_0/Data] [get_bd_addr_segs MotorControl/MotorControl2/eFPGA_AXI_LM393_driv_2/S00_AXI/S00_AXI_reg]
assign_bd_address -offset 0x43C50000 -range 64K -target_address_space [get_bd_addr_spaces processing_system7_0/Data] [get_bd_addr_segs MotorControl/MotorControl3/eFPGA_AXI_LM393_driv_3/S00_AXI/S00_AXI_reg]

validate_bd_design
save_bd_design
